# EAGLE schematic s1 (EAGLE 8.3.2)
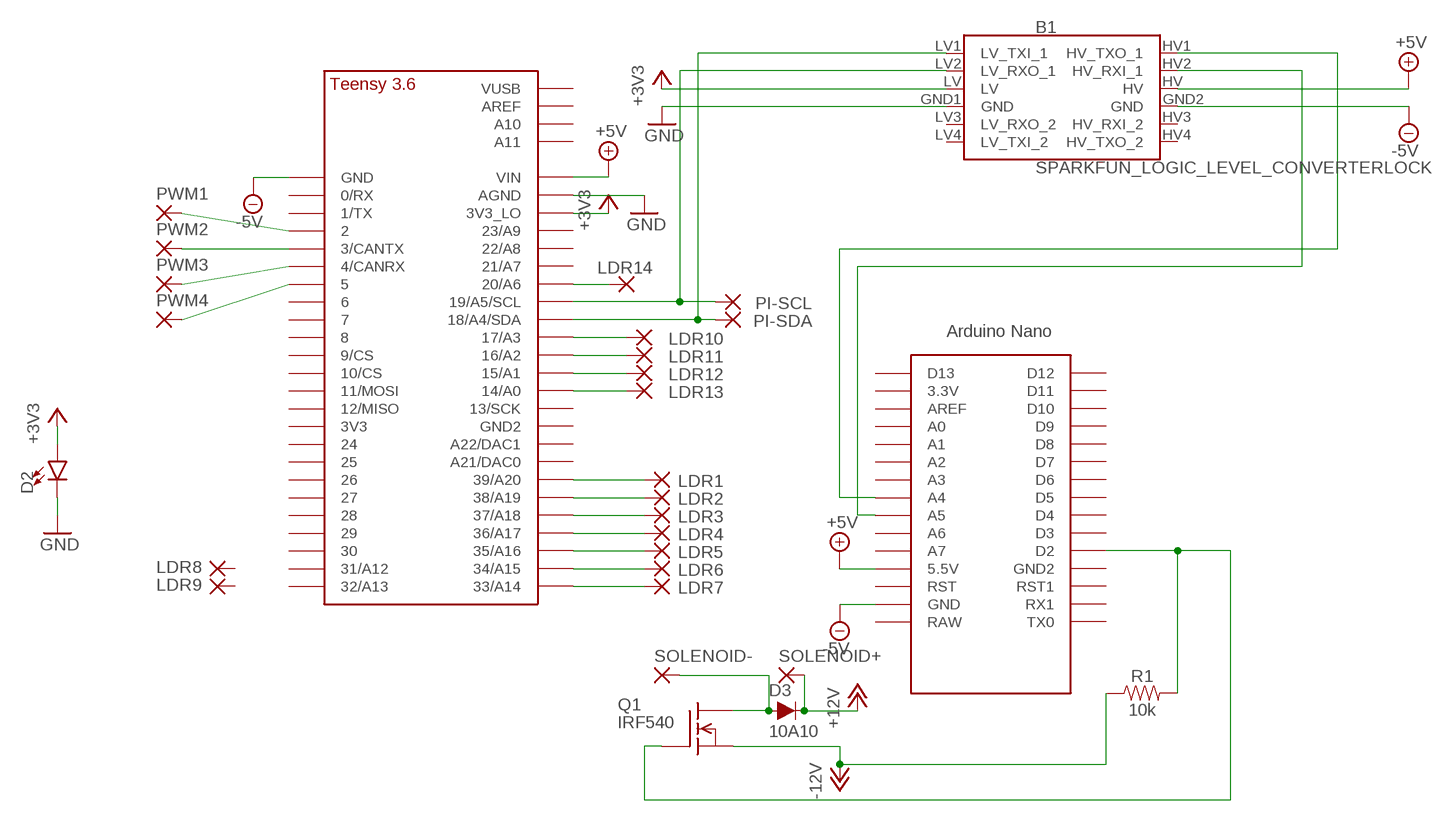
[diagram p0: schematic, sheet 1]

## Parts
B1  SPARKFUN_LOGIC_LEVEL_CONVERTERLOCK  [SPARKFUN_LOGIC_LEVEL_CONVERTER_LOCK]
D2  LED-3MM-NO_SILK  [LED_3MM-NS]
D3  10A10  DIODE-1N4148  [DIODE-1N4148]
LDR1  2,54/1,0  [2,54/1,0]
LDR2  2,54/1,0  [2,54/1,0]
LDR3  2,54/1,0  [2,54/1,0]
LDR4  2,54/1,0  [2,54/1,0]
LDR5  2,54/1,0  [2,54/1,0]
LDR6  2,54/1,0  [2,54/1,0]
LDR7  2,54/1,0  [2,54/1,0]
LDR8  2,54/1,0  [2,54/1,0]
LDR9  2,54/1,0  [2,54/1,0]
LDR10  2,54/1,0  [2,54/1,0]
LDR11  2,54/1,0  [2,54/1,0]
LDR12  2,54/1,0  [2,54/1,0]
LDR13  2,54/1,0  [2,54/1,0]
LDR14  2,54/1,0  [2,54/1,0]
PI-SCL  2,54/1,0  [2,54/1,0]
PI-SDA  2,54/1,0  [2,54/1,0]
PWM1  2,54/1,0  [2,54/1,0]
PWM2  2,54/1,0  [2,54/1,0]
PWM3  2,54/1,0  [2,54/1,0]
PWM4  2,54/1,0  [2,54/1,0]
Q1  IRF540  [TO220]
R1  10k  10KOHM-HORIZ-1/4W-1%  [AXIAL-0.3]
SOLENOID+  2,54/1,0  [2,54/1,0]
SOLENOID-  2,54/1,0  [2,54/1,0]
U$1  TEENSY_3.5/3.6_BASIC  [TEENSY_3.5/3.6_BASIC]
U$2  NANO  [NANO]

## Nets
+3V3: B1.LV D2.A U$1.3V3_LO
+5V: B1.HV U$1.VIN U$2.5V(5.5V)
+12V: D3.C SOLENOID+.1(P)
-5V: B1.GND2(GND) U$1.GND U$2.GND
-12V: Q1.3(S) R1.P$1
GND: B1.GND1(GND) D2.K(C) U$1.AGND
N$1: B1.HV1(HV_TXO_1) U$2.A4
N$2: B1.HV2(HV_RXI_1) U$2.A5
N$3: Q1.1(G) R1.P$2 U$2.D2
N$4: D3.A Q1.2(D) SOLENOID-.1(P)
N$5: B1.LV2(LV_RXO_1) PI-SCL.1(P) U$1.19/A5/SCL
N$6: B1.LV1(LV_TXI_1) PI-SDA.1(P) U$1.18/A4/SDA
N$7: PWM4.1(P) U$1.5
N$8: PWM3.1(P) U$1.4/CANRX
N$9: PWM2.1(P) U$1.3/CANTX
N$10: PWM1.1(P) U$1.2
N$11: LDR14.1(P) U$1.20/A6
N$12: LDR10.1(P) U$1.17/A3
N$13: LDR11.1(P) U$1.16/A2
N$14: LDR12.1(P) U$1.15/A1
N$15: LDR13.1(P) U$1.14/A0
N$16: LDR1.1(P) U$1.39/A20
N$17: LDR2.1(P) U$1.38/A19
N$18: LDR3.1(P) U$1.37/A18
N$19: LDR4.1(P) U$1.36/A17
N$20: LDR5.1(P) U$1.35/A16
N$21: LDR6.1(P) U$1.34/A15
N$22: LDR7.1(P) U$1.33/A14
Unconnected: B1.HV3(HV_RXI_2) B1.HV4(HV_TXO_2) B1.LV3(LV_RXO_2) B1.LV4(LV_TXI_2) LDR8.1(P) LDR9.1(P) U$1.0/RX U$1.1/TX U$1.3V3 U$1.6 U$1.7 U$1.8 U$1.9/CS U$1.10/CS U$1.11/MOSI U$1.12/MISO U$1.13/SCK U$1.21/A7 U$1.21/DAC0(A21/DAC0) U$1.22/A8 U$1.23/A9 U$1.24 U$1.25 U$1.26 U$1.27 U$1.28 U$1.29 U$1.30 U$1.31/A12 U$1.32/A13 U$1.A10 U$1.A11 U$1.A22/DAC1 U$1.AREF U$1.GND2 U$1.VUSB U$2.3.3V U$2.A0 U$2.A1 U$2.A2 U$2.A3 U$2.A6 U$2.A7 U$2.AREF U$2.D3 U$2.D4 U$2.D5 U$2.D6 U$2.D7 U$2.D8 U$2.D9 U$2.D10 U$2.D11 U$2.D12 U$2.D13 U$2.GND1(GND2) U$2.ICSP1 U$2.ICSP2 U$2.ICSP3 U$2.ICSP4 U$2.ICSP5 U$2.ICSP6 U$2.RAW U$2.RST U$2.RST1 U$2.RX1 U$2.TX0

## Library data of the parts
B1 = SparkFun-Boards:SPARKFUN_LOGIC_LEVEL_CONVERTER: SparkFun Logic Level Converter -Bi-Directional This is the mechnical outline for the 3.3V - 5V bi directional logic level converter. *Note, the "LOCK" Package has the header pins staggered by an offset of 5 mils (off center line), so that when you slide a row of standard 0.1" headers into the PTH pads, it will hold position vertically. See the follwing turorial for more information on this type of special footprints: Sneaky Footprints <https://www.sparkfun.com/tutorials/114> SparkFun Products: SparkFun Logic Level Converter - Bi-Directional <https://www.sparkfun.com/products/12009>
D2 = SparkFun-LED:LED: LED (Generic) Standard schematic elements and footprints for 5mm, 3mm, 1206, and 0603 sized LEDs. Generic LEDs with no color specified.
D3 = SparkFun-DiscreteSemi:DIODE: Diode These are standard reverse protection diodes and small signal diodes. SparkFun Products: SparkFun SparkPunk Sound Kit <https://www.sparkfun.com/products/11177> SparkFun ESP8266 Thing <https://www.sparkfun.com/products/13231>; PROD_ID: DIO-08378; VALUE: 200mA/100V/1V
LDR1-LDR14 PI-SCL PI-SDA PWM1-PWM4 SOLENOID+ SOLENOID- = wirepad:2,54/1,0: THROUGH-HOLE PAD
Q1 = transistor-fet:IRF540: N-Channel Enhancement MOSFET (HEXFET); 100V; 28A; 0,077Ohm
R1 = SparkFun-Resistors:10KOHM: 10kΩ resistor A resistor is a passive two-terminal electrical component that implements electrical resistance as a circuit element. Resistors act to reduce current flow, and, at the same time, act to lower voltage levels within circuits. - Wikipedia; PROD_ID: RES-12183
U$1 = Teensy356:TEENSY_3.5/3.6_BASIC
U$2 = Arduino-clone:NANO: Arduino Nano